# EAGLE design 4-pin SOT-89+SOT-223 (EAGLE 6.3)
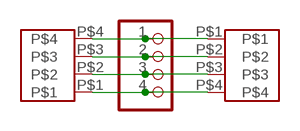
[diagram p0: schematic, sheet 1]

## Parts
JP1  PADS-4  [PADS-4]
U$1  SOT89  [SOT89]
U$2  SOT223  [SOT223]

## Nets
N$1: JP1.1 U$1.P$1 U$2.P$4
N$2: JP1.2 U$1.P$2 U$2.P$3
N$3: JP1.3 U$1.P$3 U$2.P$2
N$4: JP1.4 U$1.P$4 U$2.P$1

## Library data of the parts
JP1 = breakouts:PADS-4: PIN HEADER
U$1 = breakouts:SOT89
U$2 = breakouts:SOT223

## Board
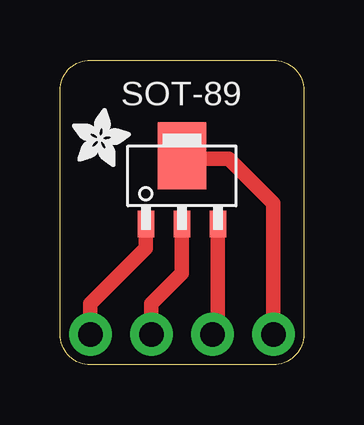
[diagram p1: board, top side]
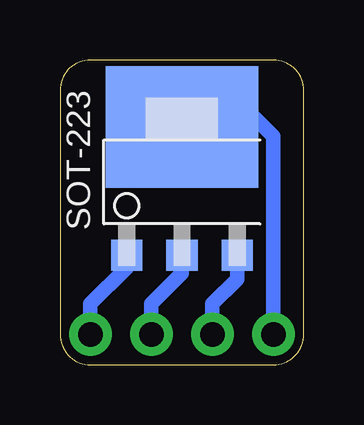
[diagram p2: board, bottom side, seen from below]

Size 10.16 x 12.7 mm. Coordinates in mm from the lower left corner, seen from the top.
Outline: 0,1.27 0,11.43 arc-90 1.27,12.7 8.89,12.7 arc-90 10.16,11.43 10.16,1.27 arc-90 8.89,0 1.27,0 arc-90 0,1.27
Copper layers (1*16): Top 0.035mm / dielectric 1.5mm / Bottom 0.035mm
Design rules "default": minimum track width 10mil, minimum drill 16mil, track to track 8mil, track to pad 8mil, pad to pad 8mil, via to via 8mil, smd to smd 8mil, copper to edge 10mil, drill to drill 8mil, minimum pad ring 10mil, minimum via ring 8mil, stop-mask expansion 4mil, vias tented up to drill 20mil, thermal gap 10mil

### Footprints (pad centres in the part's own frame; a part is rotated, then mirrored left to right if it is on the bottom)
PADS-4 = drill 1.016 pad 1.778: 1 -3.81,0; 2 -1.27,0; 3 1.27,0; 4 3.81,0
SOT89 = smd 0.7 x 1.1: P$1 -1.5,-1.75; P$2 0,-1.75; P$3 1.5,-1.75 | smd 2.032 x 2.794: P$4 0,1.088
SOT223 = smd 1.3 x 1.3: P$1 -2.3,-3.05; P$2 0,-3.05; P$3 2.3,-3.05 | smd 6.35 x 5.08: P$4 0,2.288

### Placement (x,y rotation side)
JP1  5.08,1.27 0 top
U$1  5.08,7.62 0 top
U$2  5.08,7.62 0 bottom
U$3  [ADAFRUIT_2.5MM]  0.51,8.26 0 top

### Tracks (layer width: path | path; a pad name or v marks a point on that pad's centre or on a via)
N$1
  Top 0.61: U$1.P$1 3.58,4.85 1.27,2.54 JP1.1
  Bottom 0.61: JP1.1 1.27,9.53 2.54,10.79 4.96,10.79 4.96,9.91 U$2.P$4
N$2
  Top 0.61: U$1.P$2 5.08,3.81 3.81,2.54 JP1.2
  Bottom 0.61: U$2.P$3 2.78,3.57 3.81,2.54 JP1.2
N$3
  Top 0.406: 6.58,1.5 JP1.3
  Top 0.61: U$1.P$3 6.58,1.5
  Bottom 0.61: U$2.P$2 5.08,3.81 6.35,2.54 JP1.3
N$4
  Top 0.61: JP1.4 8.89,6.73 7.04,8.58 5.08,8.58 U$1.P$4
  Bottom 0.61: U$2.P$1 7.38,4.05 8.89,2.54 JP1.4

### Text on the board
tPlace: SOT-89
bPlace: SOT-223